# EAGLE design Adafruit Flora LSM303 (EAGLE 6.2)
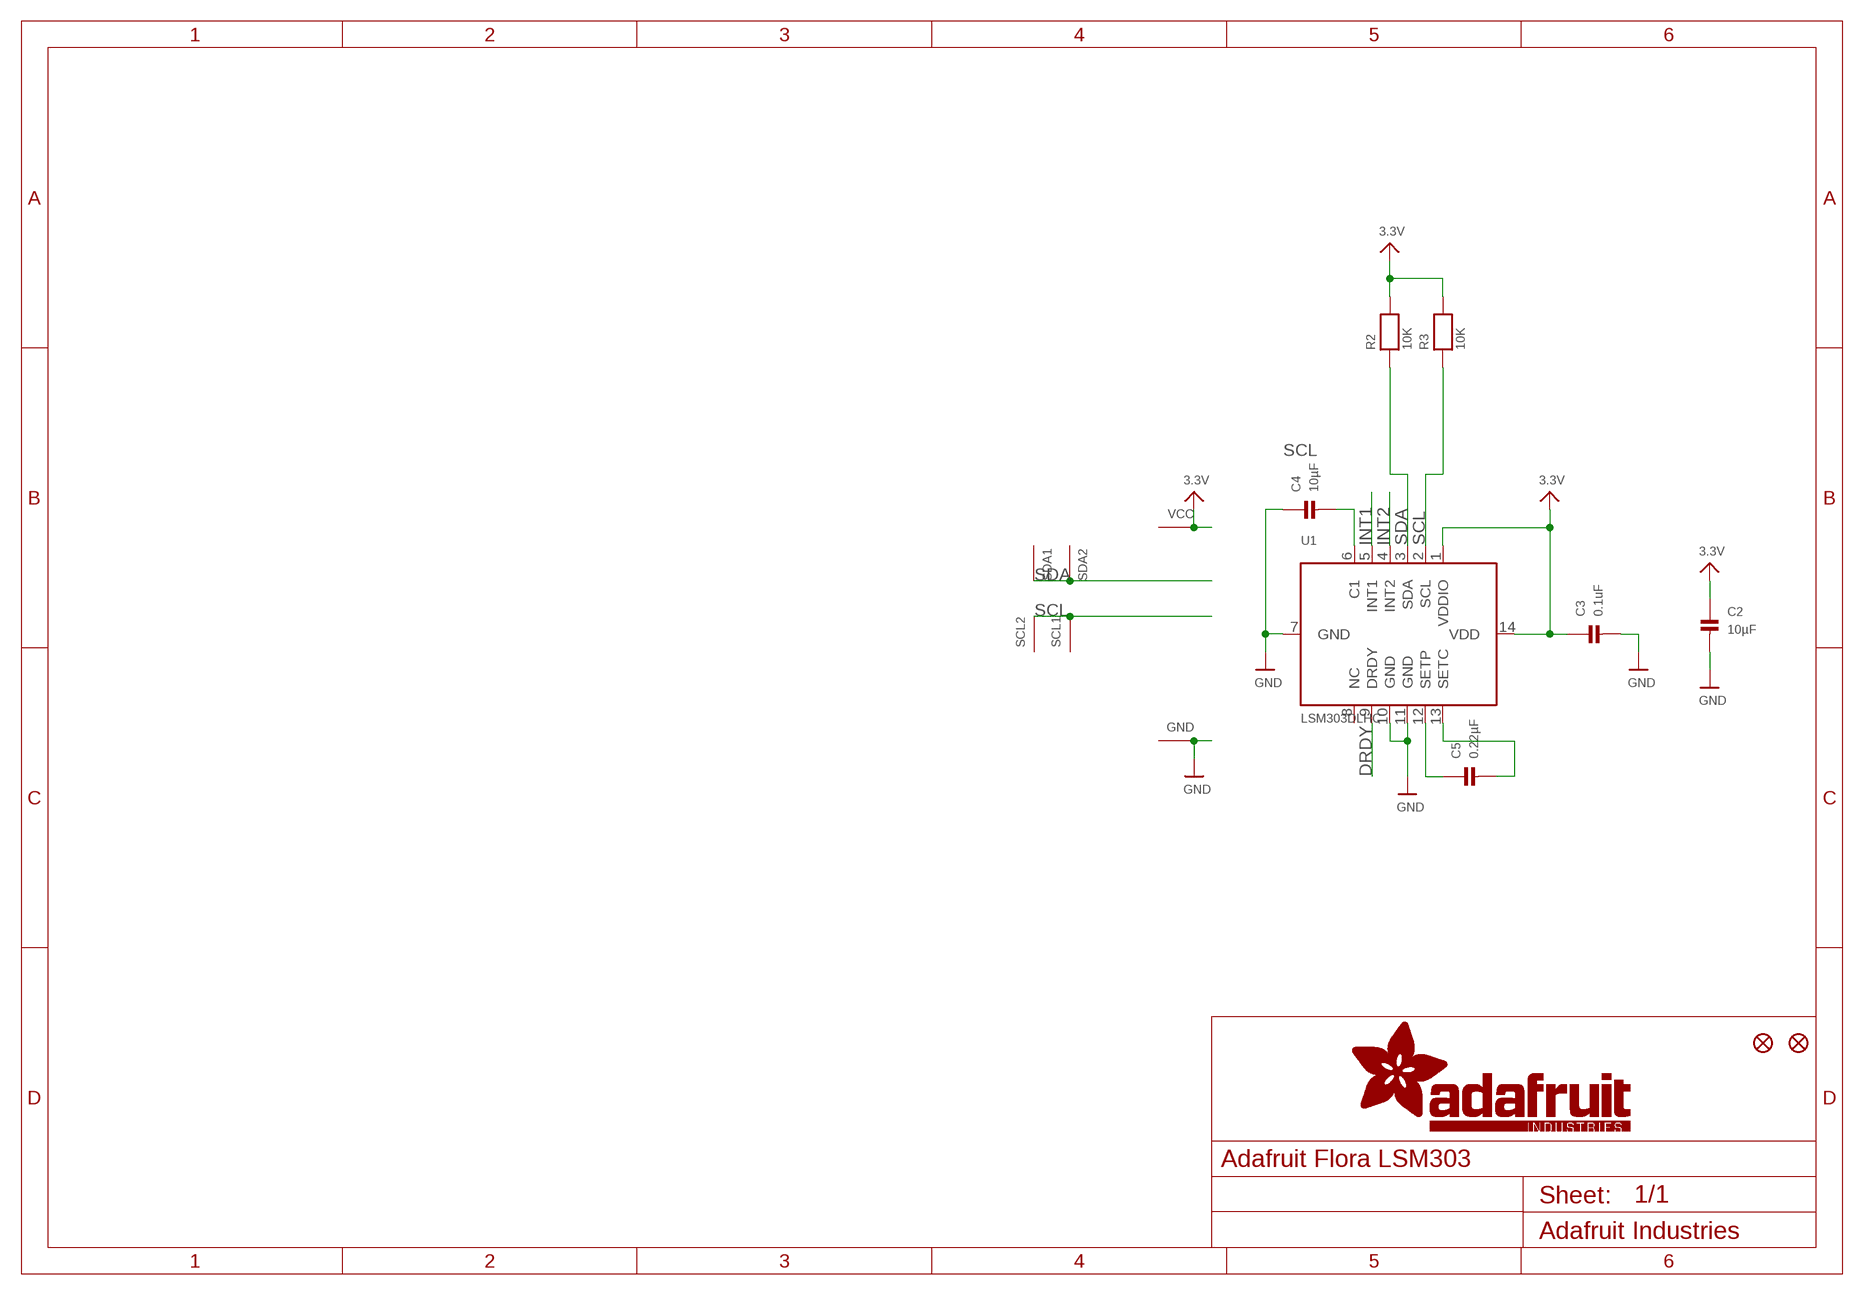
[diagram p0: schematic, sheet 1]

## Parts
C2  10µF  CAP_CERAMIC_0805  [_0805]
C3  0.1uF  CAP_CERAMIC_0805  [_0805]
C4  10µF  CAP_CERAMIC_0805  [_0805]
C5  0.22µF  CAP_CERAMIC_0805  [_0805]
FID1  FIDUCIAL""  [FIDUCIAL_1MM]
FID2  FIDUCIAL""  [FIDUCIAL_1MM]
GND  SEWTAP0.5IN  [SEWINGTAP_0.5]
R2  10K  RESISTOR_0805  [_0805]
R3  10K  RESISTOR_0805  [_0805]
SCL1  SEWTAP0.5IN  [SEWINGTAP_0.5]
SCL2  SEWTAP0.5IN  [SEWINGTAP_0.5]
SDA1  SEWTAP0.5IN  [SEWINGTAP_0.5]
SDA2  SEWTAP0.5IN  [SEWINGTAP_0.5]
U1  LSM303DLHC  [LGA14]
VCC  SEWTAP0.5IN  [SEWINGTAP_0.5]

## Nets
3.3V: C2.1 C3.1 R2.2 R3.2 U1.1(VDDIO) U1.14(VDD) VCC.TAP(SEW)
DRDY: U1.9(DRDY)
GND: C2.2 C3.2 C4.1 GND.TAP(SEW) U1.7(GND) U1.10(GND) U1.11(GND)
INT1: U1.5(INT1)
INT2: U1.4(INT2)
N$3: C4.2 U1.6(C1)
N$4: C5.1 U1.12(SETP)
N$5: C5.2 U1.13(SETC)
SCL: R3.1 SCL1.TAP(SEW) SCL2.TAP(SEW) U1.2(SCL)
SDA: R2.1 SDA1.TAP(SEW) SDA2.TAP(SEW) U1.3(SDA)
Unconnected: U1.8(NC)

## Library data of the parts
C2-C5 = microbuilder:CAP_CERAMIC: Ceramic Capacitors 0402 - 0402 Surface Mount Capacitors 16pF 50V 5% [Digikey: 445-4899-2-ND] 18pF 50V 5% [Digikey: 490-1281-2-ND] 22pF 50V 5% [Digikey: 490-1283-2-ND] 68pF 50V 5% [Digikey: 490-1289-2-ND] 0.1uF 10V 10% [Digikey: 490-1318-2-ND] 1.0uF 6.3V 10% [Digikey: 490-1320-2-ND] 0603 - 0603 Surface Mount Capacitors 16 pF 50V 5% [Digikey: 445-5051-2-ND] 22 pF 50V [Digikey: PCC220ACVTR-ND] 33 pF 50V 5% [Digikey: 490-1415-1-ND] 56pF 50V 5% [Digikey: 490-1421-1-ND] 220pF 50V 5% [Digikey: 445-1285-1-ND] 680 pF 50V 2200 pF 50V 5% C0G [Digikey: 445-1297-1-ND] 5600 pF 100V 5% X7R [Digikey: 478-3711-1-ND] 0.1 µF 25V 10% [Digikey: PCC2277TR-ND] 0.22 µF 16V 10% X7R [Digikey: 445-1318-1-ND] 1.0 µF 25V 10% [Digikey: 445-5146-2-ND] 0603 - RF Specific 3pF 250V +/-0.1pF RF [Digikey: 712-1347-1-ND] 18 pF 250V 5% [Digikey: 478-3505-1-ND or 712-1322-1-ND] 56 pF 250V 5% C0G RF [Digikey: 490-4867-1-ND] 68 pF 250V RF [Digikey: 490-4868-1-ND] 0805 - 0805 Surface Mount Capacitors 220 pF 250V 2% RF Ceramic Capacitor [Digikey: 712-1398-1-ND] 1000 pF 50V 2% NP0 Ceramic Capacitor [Digikey: 478-3760-1-ND] 0.1 µF 25V 10% Ceramic Capacitor [Digikey: PCC1828TR-ND] 1.0 µF 16V 10% Ceramic Capacitor[Digikey: 490-1691-2-ND] 10.0 µF 10V 10% Ceramic Capacitor[Digikey: 709-1228-1-ND] 10.0 uF 16V 10% Ceramic Capacitor [Digikey: 478-5165-2-ND] 47 uF 6.3V 20% Ceramic Capacitor [Digikey: 587-1779-1-ND or 399-5506-1-ND] 1206 - 1206 Surface Mount Capacitors 47uF 10V 20% Ceramic Capacitor [Digikey: 490-5528-1-ND or 399-5508-1-ND or 445-6010-1-ND] 100uF 6.3V -20%, +80% Y5V Ceramic Capacitor (Digikey: 490-4512-1-ND, Mouser: 81-GRM31CF50J107ZE1L)
FID1 FID2 = microbuilder:FIDUCIAL: Fiducial Alignment Points Various fiducial points for machine vision alignment.
GND SCL1 SCL2 SDA1 SDA2 VCC = adafruit:SEWTAP
R2 R3 = microbuilder:RESISTOR: Resistors 0402 - 0402 Surface Mount Package 22 Ohm 1% 1/16W [Digikey: 311-22.0LRTR-ND] 33 Ohm 5% 1/16W 1.0K 5% 1/16W 1.5K 5% 1/16W 2.0K 1% 1/16W 10.0K 1% 1/16W [Digikey: 311-10.0KLRTR-ND] 10.0K 5% 1/16W [Digikey: RMCF0402JT10K0TR-ND] 12.1K 1% 1/16W [Digikey: 311-22.0LRTR-ND] 100.0K 5% 1/16W 0603 - 0603 Surface Mount Package 0 Ohm 1/10 Watt 1% Resistor 15 Ohm 1/10 Watt 1% Resistor 33 Ohm 1/10 Watt 1% Resistor 49.9 Ohm 1/10 Watt 1% Resistor 100 Ohm 1/10 Watt 1% Resistor 150 Ohm 1/10 Watt 1% Resistor 240 Ohm 1/10 Watt 1% Resistor 390 Ohm 1/10 Watt 1% Resistor 560 Ohm 1/10 Watt 1% Resistor 680 Ohm 1/10 Watt 1% Resistor 750 Ohm 1/10 Watt 1% Resistor 1.0K Ohm 1/10 Watt 1% Resistor 1.5K Ohm 1/10 Watt 1% Resistor 2.0K Ohm 1/10 Watt 1% Resistor 2.2K Ohm 1/10 Watt 1% Resistor 3.3K Ohm 1/10 Watt 1% Resistor 4.7K Ohm 1/10 Watt 1% Resistor 10.0K Ohm 1/10 Watt 1% Resistor 12.0K Ohm 1/10 Watt 1% Resistor 12.1K Ohm 1/10 Watt 1% Resistor 20.0K Ohm 1/10 Watt 1% Resistor 33.0K Ohm 1/10 Watt 1% Resistor 100.0K Ohm 1/10 Watt 1% Resistor 0805 - 0805 Surface Mount Package 0 Ohm 1/8 Watt 1% Resistor 33 Ohm 1/8 Watt 1% Resistor 100 Ohm 1/8 Watt 1% Resistor 150 Ohm 1/8 Watt 1% Resistor 200 Ohm 1/8 Watt 1% Resistor 240 Ohm 1/8 Watt 1% Resistor 330 Ohm 1/8 Watt 1% Resistor 390 Ohm 1/8 Watt 1% Resistor 470 Ohm 1/8 Watt 1% Resistor 1.0K Ohm 1/8 Watt 1% Resistor 1.5K Ohm 1/8 Watt 1% Resistor 2.0K Ohm 1/8 Watt 1% Resistor 4.7K Ohm 1/8 Watt 1% Resistor 5.1K Ohm 1/8 Watt 1% Resistor 5.6K Ohm 1/8 Watt 1% Resistor 10.0K Ohm 1/8 Watt 1% Resistor 22.0K Ohm 1/8 Watt 1% Resistor 33.0K Ohm 1/8 Watt 1% Resistor 100K Ohm 1/8 Watt 1% Resistor 1206 - 1206 Surface Mount Package 2012 - 2010 Surface Mount Package 0.11 Ohm 1/2 Watt 1% Resistor - Digikey: RHM.11UCT-ND
U1 = microbuilder:LSM303DLHC: LSM303DLHC 3-Axis I2C Accelerometer and 3-Axis Magnetometer VDD: 2.2-3.6V VDDIO: 1.8-VDD Magnetic Range: +/-1.3 to +/-8.1 gauss Accel Range: +/-2/4/8/16 g Temp: -40 - 85°C

## Board
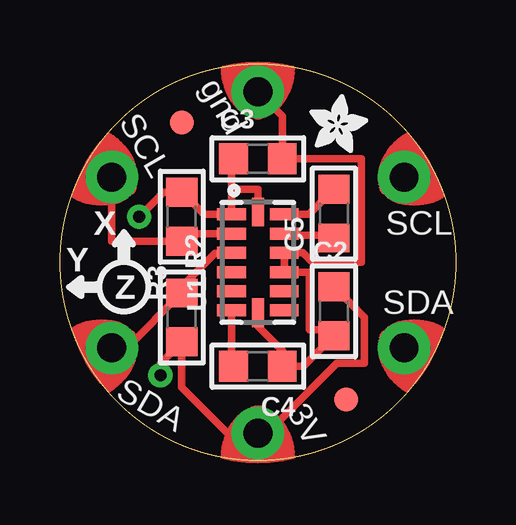
[diagram p1: board, top side]
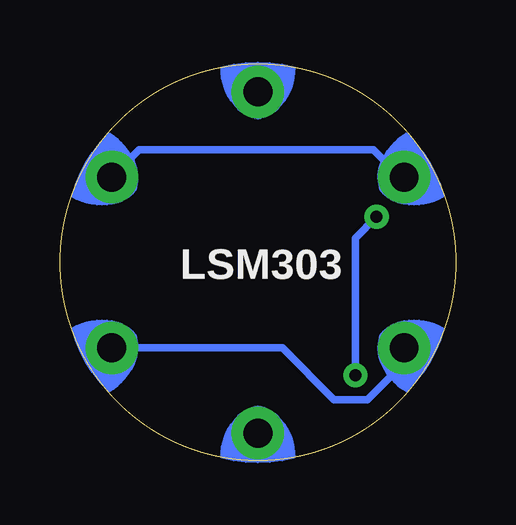
[diagram p2: board, bottom side, seen from below]

Size 16.51 x 16.51 mm. Coordinates in mm from the lower left corner, seen from the top.
Outline: circle at 8.26,8.26 radius 8.26
Copper layers (1*16): Top 0.035mm / dielectric 1.5mm / Bottom 0.035mm
Design rules "default": minimum track width 8mil, minimum drill 0.4mm, track to track 8mil, track to pad 8mil, pad to pad 8mil, via to via 8mil, smd to smd 8mil, copper to edge 20mil, drill to drill 8mil, minimum pad ring 8mil, minimum via ring 10mil, stop-mask expansion 3mil, vias tented up to drill 20mil, thermal gap 8mil

### Footprints (pad centres in the part's own frame; a part is rotated, then mirrored left to right if it is on the bottom)
_0805 = smd 1.2 x 1.3: 1 -1.016,0; 2 1.016,0
FIDUCIAL_1MM = smd 1 x 1: 1 0,0
SEWINGTAP_0.5 = drill 1.2 pad 2.184: TAP 0,0
LGA14 = smd 0.5 x 1.2: 1 2,1.1; 2 1.2,1.1; 3 0.4,1.1; 4 -0.4,1.1; 5 -1.2,1.1; 6 -2,1.1; 8 -2,-1.1; 9 -1.2,-1.1; 10 -0.4,-1.1; 11 0.4,-1.1; 12 1.2,-1.1; 13 2,-1.1 | smd 1.2 x 0.5: 7 -2.1,0; 14 2.1,0

### Placement (x,y rotation side)
C2  11.43,6.22 270 top
C3  8.26,12.57 0 top
C4  8.26,3.94 180 top
C5  11.43,10.29 90 top
FID1  5.08,14.1 0 top
FID2  11.94,2.54 0 top
GND  8.26,15.37 0 top
R2  5.08,5.97 270 top
R3  5.08,10.16 90 top
SCL1  14.35,11.81 300 top
SCL2  2.16,11.81 60 top
SDA1  14.35,4.7 240 top
SDA2  2.16,4.7 120 top
U1  8.26,8.26 90 top
U$4  [ADAFRUIT_2.5MM]  10.41,12.83 0 top
VCC  8.26,1.14 180 top

### Tracks (layer width: path | path; a pad name or v marks a point on that pad's centre or on a via)
3.3V  (via drill 0.5)
  Top 0.305: C3.1 7.16,12.49 7.16,11.3 | 7.16,11.3 U1.1 6,10.26 R3.2 4.32,11.18 v3.3,10.16 | U1.14 8.26,11.3 7.16,11.3 | v4.19,3.56 4.19,4.06 R2.2 5.08,3.05 7.37,0.76 7.87,0.76 VCC.TAP 8.64,1.14 11.56,4.06 12.7,4.06 12.7,5.97 C2.1
  Bottom 0.305: v4.19,3.56 4.19,9.27 v3.3,10.16
GND
  Top 0.305: GND.TAP 9.27,14.35 C3.2 12.57,12.57 12.57,8.26 10.54,8.26 10.14,8.66 U1.11 U1.10 | 9.34,7.87 U1.10 | U1.7 8.26,5.59 9.27,4.57 C4.1 10.16,3.94 C2.2 11.43,5.46 10.41,5.46 10.41,7.86 U1.10
N$3
  Top 0.305: U1.6 7.16,4.02 C4.2
N$4
  Top 0.305: U1.12 9.41,9.4 11.18,9.4 C5.1
N$5
  Top 0.305: C5.2 10.38,10.26 U1.13
SCL
  Top 0.305: U1.2 5.39,9.46 R3.1 2.16,9.14 SCL2.TAP
  Bottom 0.305: SCL1.TAP 13.21,12.95 3.43,12.95 2.29,11.81 SCL2.TAP
SDA
  Top 0.305: SDA2.TAP 2.79,4.7 R2.1 5.08,7.24 6.48,8.64 7.14,8.64 U1.3
  Bottom 0.305: SDA2.TAP 2.16,4.06 3.68,2.54 5.08,2.54 7.24,4.7 SDA1.TAP

### Text on the board
tPlace: gnd | SCL | X | SCL | Y | Z | SDA | SDA | 3V
bPlace: LSM303